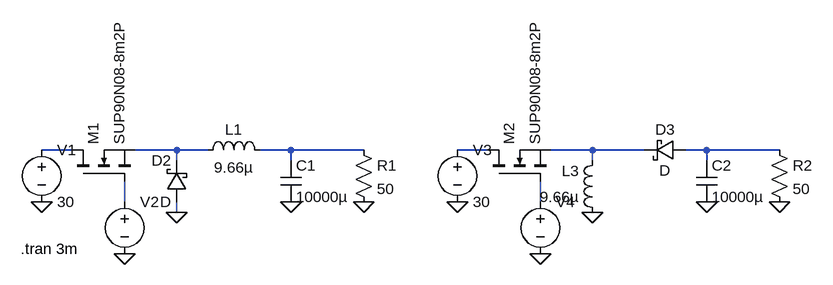
[diagram p0: schematic Switch_mode.asc]
Switch_mode.asc, the LTspice schematic file:
Version 4
SHEET 1 1064 680
WIRE -80 128 -128 128
WIRE 80 128 16 128
WIRE 128 128 80 128
WIRE 256 128 208 128
WIRE 368 128 256 128
WIRE 560 128 512 128
WIRE 720 128 656 128
WIRE 800 128 720 128
WIRE 896 128 864 128
WIRE 1008 128 896 128
WIRE 80 144 80 128
WIRE 256 144 256 128
WIRE 720 144 720 128
WIRE 896 144 896 128
WIRE 0 208 0 176
WIRE 640 208 640 176
WIRE 80 224 80 208
FLAG 256 208 0
FLAG 368 208 0
FLAG 80 224 0
FLAG -128 208 0
FLAG 0 288 0
FLAG 896 208 0
FLAG 1008 208 0
FLAG 720 224 0
FLAG 512 208 0
FLAG 640 288 0
SYMBOL cap 240 144 R0
SYMATTR InstName C1
SYMATTR Value 10000µ
SYMBOL nmos -80 176 R270
SYMATTR InstName M1
SYMATTR Value SUP90N08-8m2P
SYMBOL voltage -128 112 R0
WINDOW 123 0 0 Left 0
WINDOW 39 0 0 Left 0
SYMATTR InstName V1
SYMATTR Value 30
SYMBOL voltage 0 192 R0
WINDOW 3 24 96 Invisible 2
WINDOW 123 0 0 Left 0
WINDOW 39 0 0 Left 0
SYMATTR Value PULSE(0 35 0 0 0 21n 139.2n)
SYMATTR InstName V2
SYMBOL res 352 112 R0
SYMATTR InstName R1
SYMATTR Value 50
SYMBOL cap 880 144 R0
SYMATTR InstName C2
SYMATTR Value 10000µ
SYMBOL nmos 560 176 R270
SYMATTR InstName M2
SYMATTR Value SUP90N08-8m2P
SYMBOL voltage 512 112 R0
WINDOW 123 0 0 Left 0
WINDOW 39 0 0 Left 0
SYMATTR InstName V3
SYMATTR Value 30
SYMBOL voltage 640 192 R0
WINDOW 3 24 96 Invisible 2
WINDOW 123 0 0 Left 0
WINDOW 39 0 0 Left 0
SYMATTR Value PULSE(0 35 0 0 0 32n 139.2n)
SYMATTR InstName V4
SYMBOL res 992 112 R0
SYMATTR InstName R2
SYMATTR Value 50
SYMBOL ind 736 240 R180
WINDOW 0 36 80 Left 2
WINDOW 3 36 40 Left 2
SYMATTR InstName L3
SYMATTR Value 9.66µ
SYMBOL schottky 864 112 R90
WINDOW 0 0 32 VBottom 2
WINDOW 3 32 32 VTop 2
SYMATTR InstName D3
SYMBOL ind 112 144 R270
WINDOW 0 32 56 VTop 2
WINDOW 3 5 56 VBottom 2
SYMATTR InstName L1
SYMATTR Value 9.66µ
SYMBOL schottky 96 208 R180
WINDOW 0 24 64 Left 2
WINDOW 3 24 0 Left 2
SYMATTR InstName D2
TEXT -160 280 Left 2 !.tran 3m

The netlist it stands for:
* Switch_mode.asc
C1 N003 0 10000µ
M1 N001 N007 N002 N002 SUP90N08-8m2P
V1 N001 0 30
V2 N007 0 PULSE(0 35 0 0 0 21n 139.2n)
R1 N003 0 50
C2 N006 0 10000µ
M2 N004 N008 N005 N005 SUP90N08-8m2P
V3 N004 0 30
V4 N008 0 PULSE(0 35 0 0 0 32n 139.2n)
R2 N006 0 50
L3 0 N005 9.66µ
D3 N006 N005 D
L1 N002 N003 9.66µ
D2 0 N002 D
.model D D
.lib standard.dio
.model NMOS NMOS
.model PMOS PMOS
.lib standard.mos
.tran 3m
.backanno
.end